# EAGLE schematic dev-board1 (EAGLE 9.0.1)
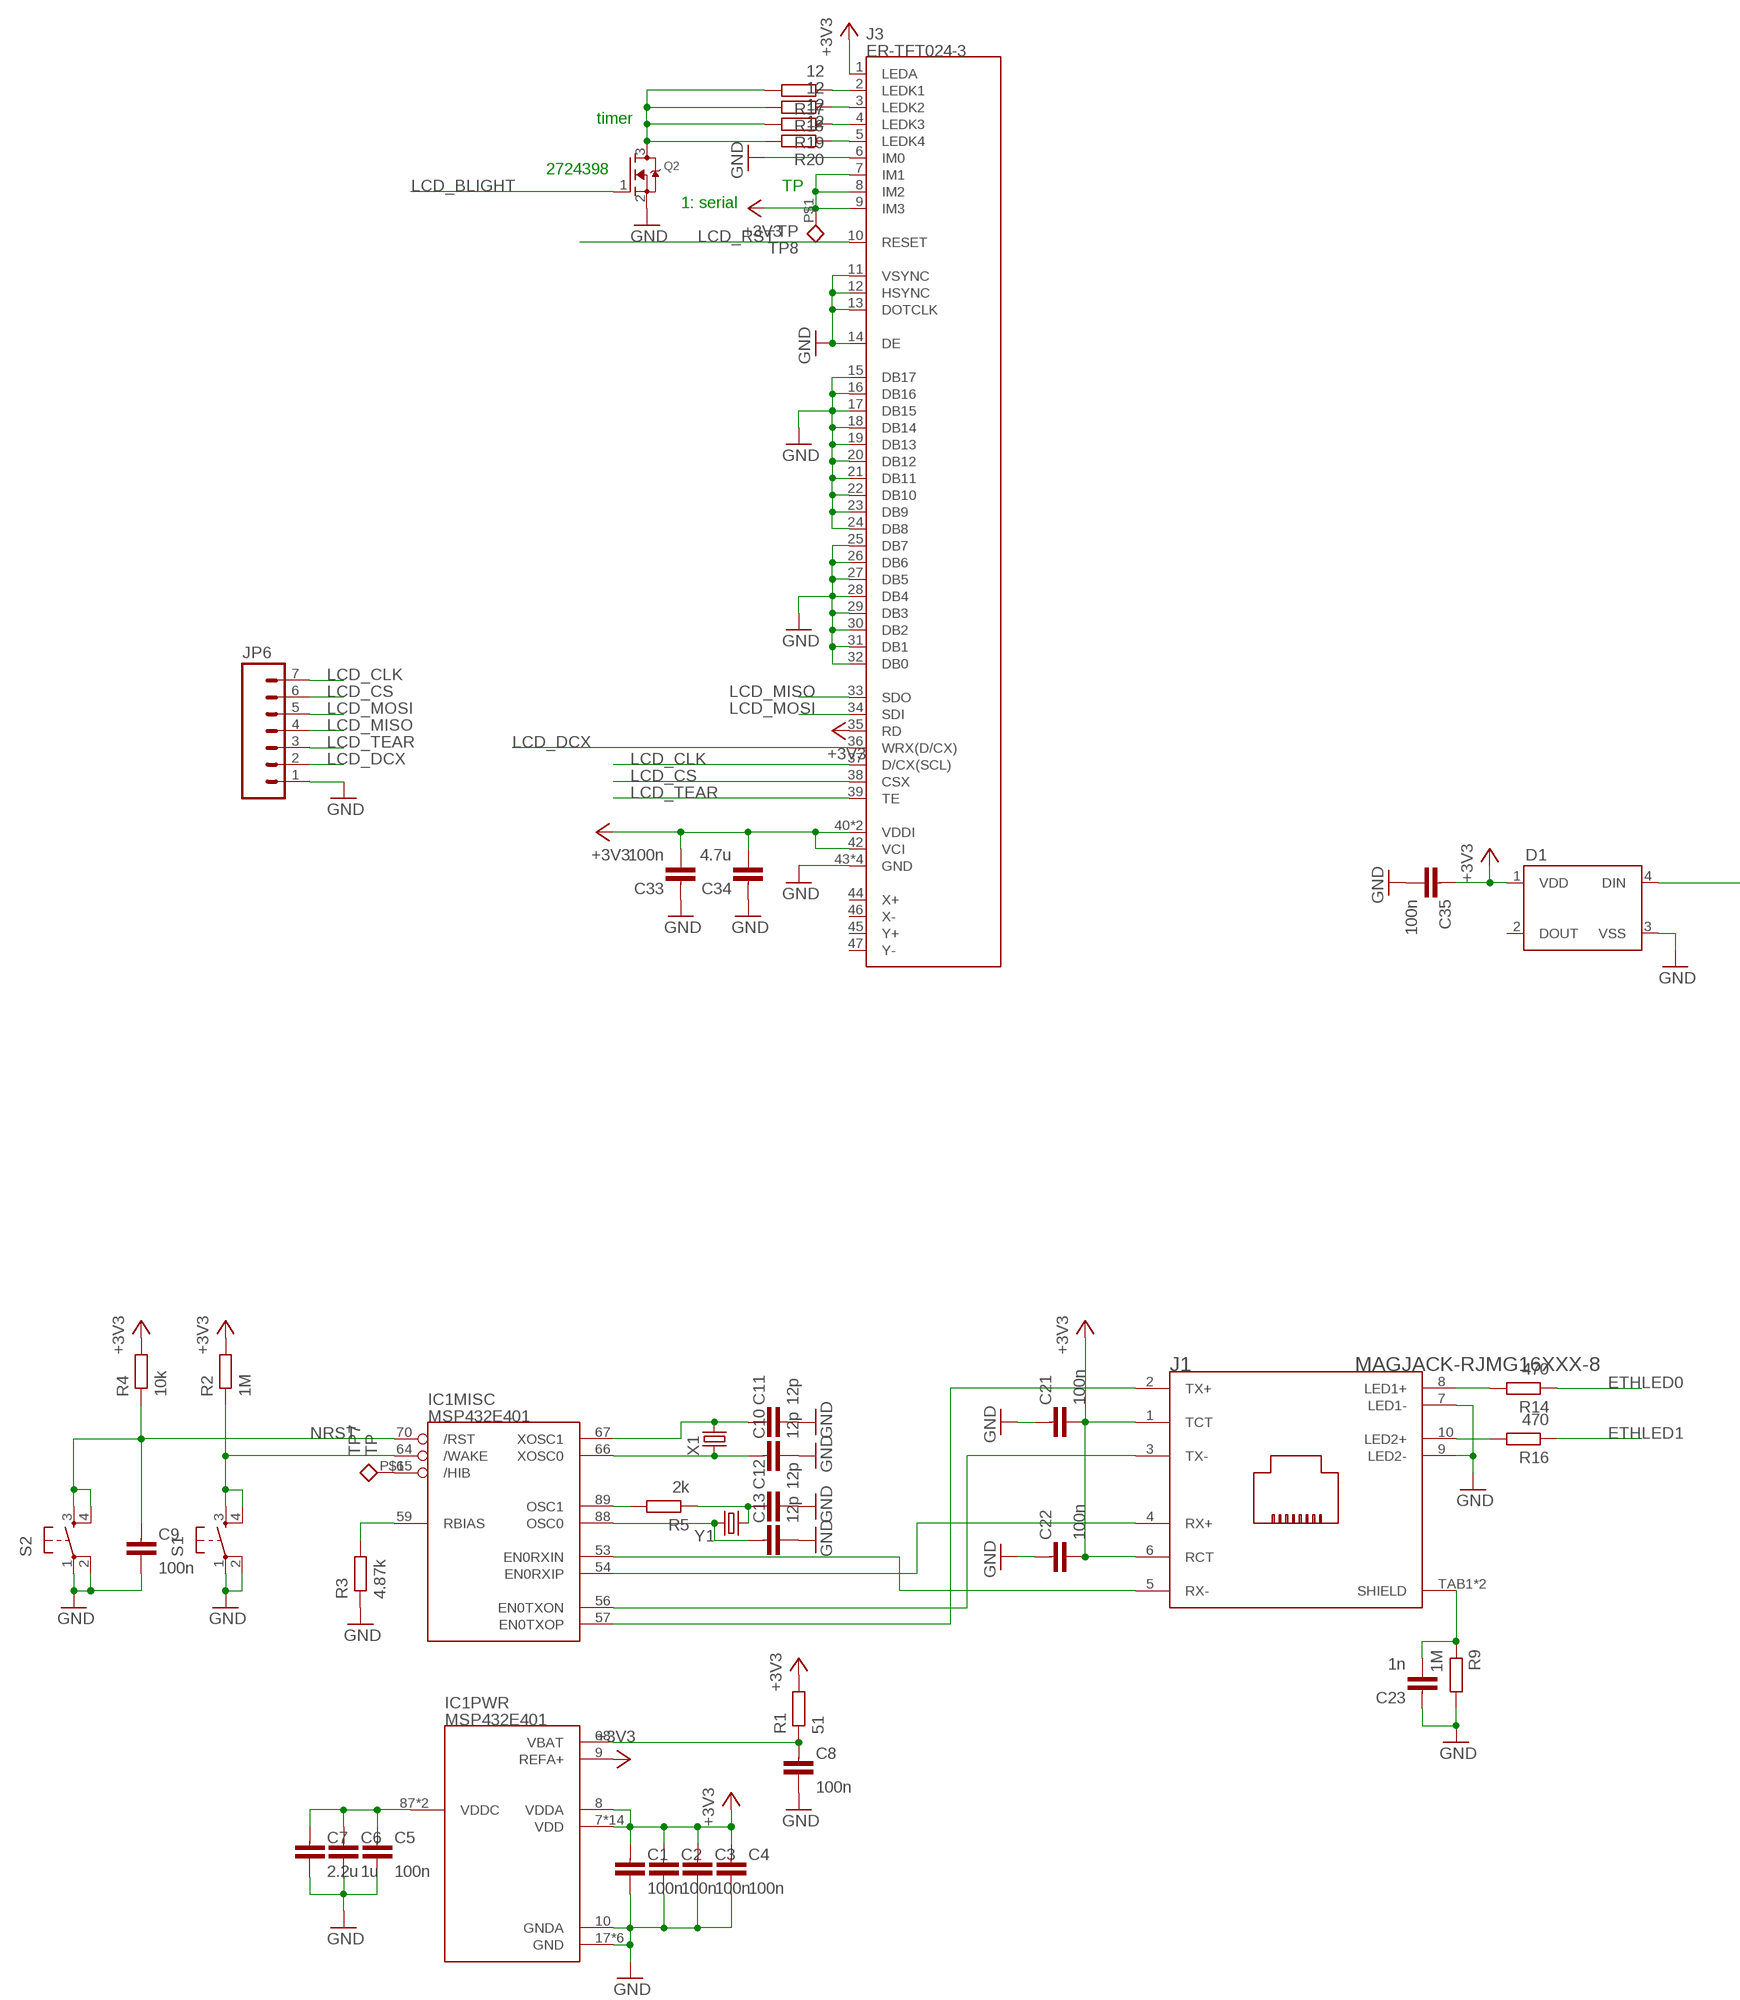
[diagram p0: schematic, sheet 1, part 1 of 3]
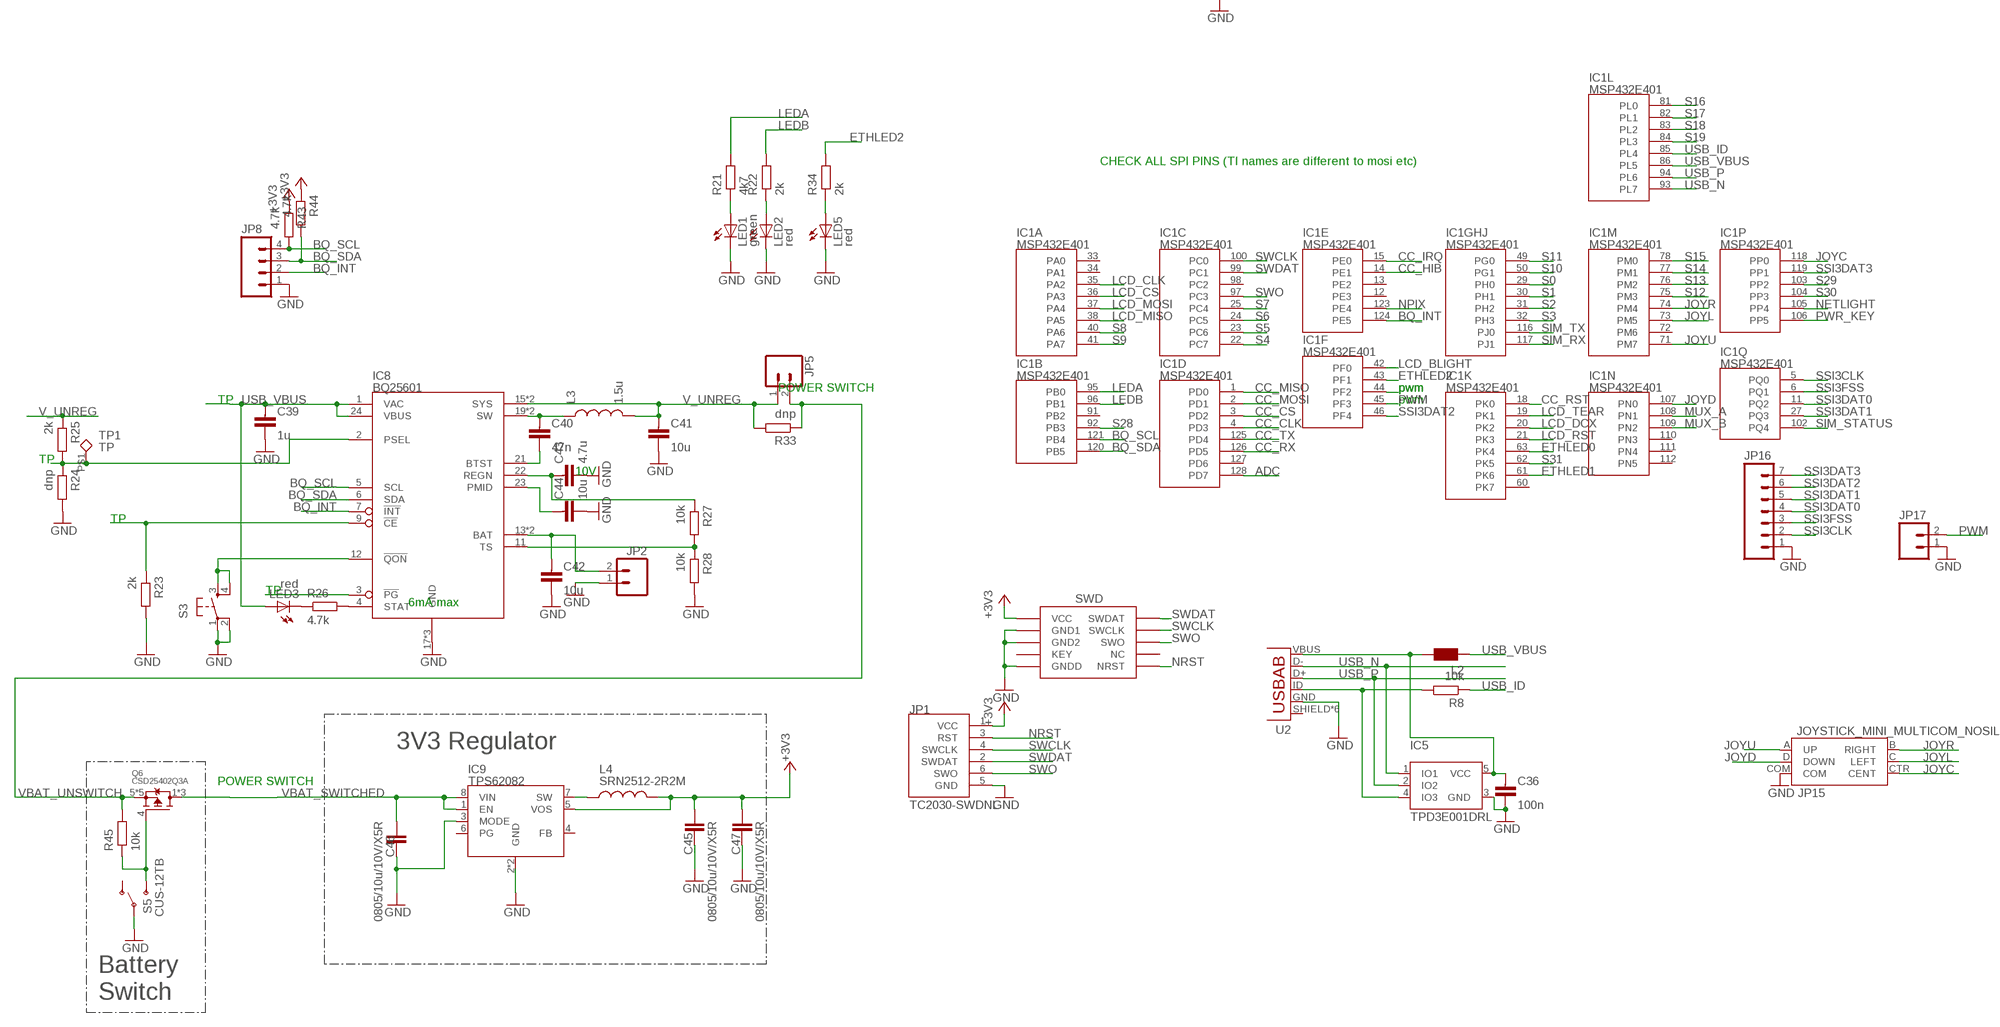
[diagram p1: schematic, sheet 1, part 2 of 3]
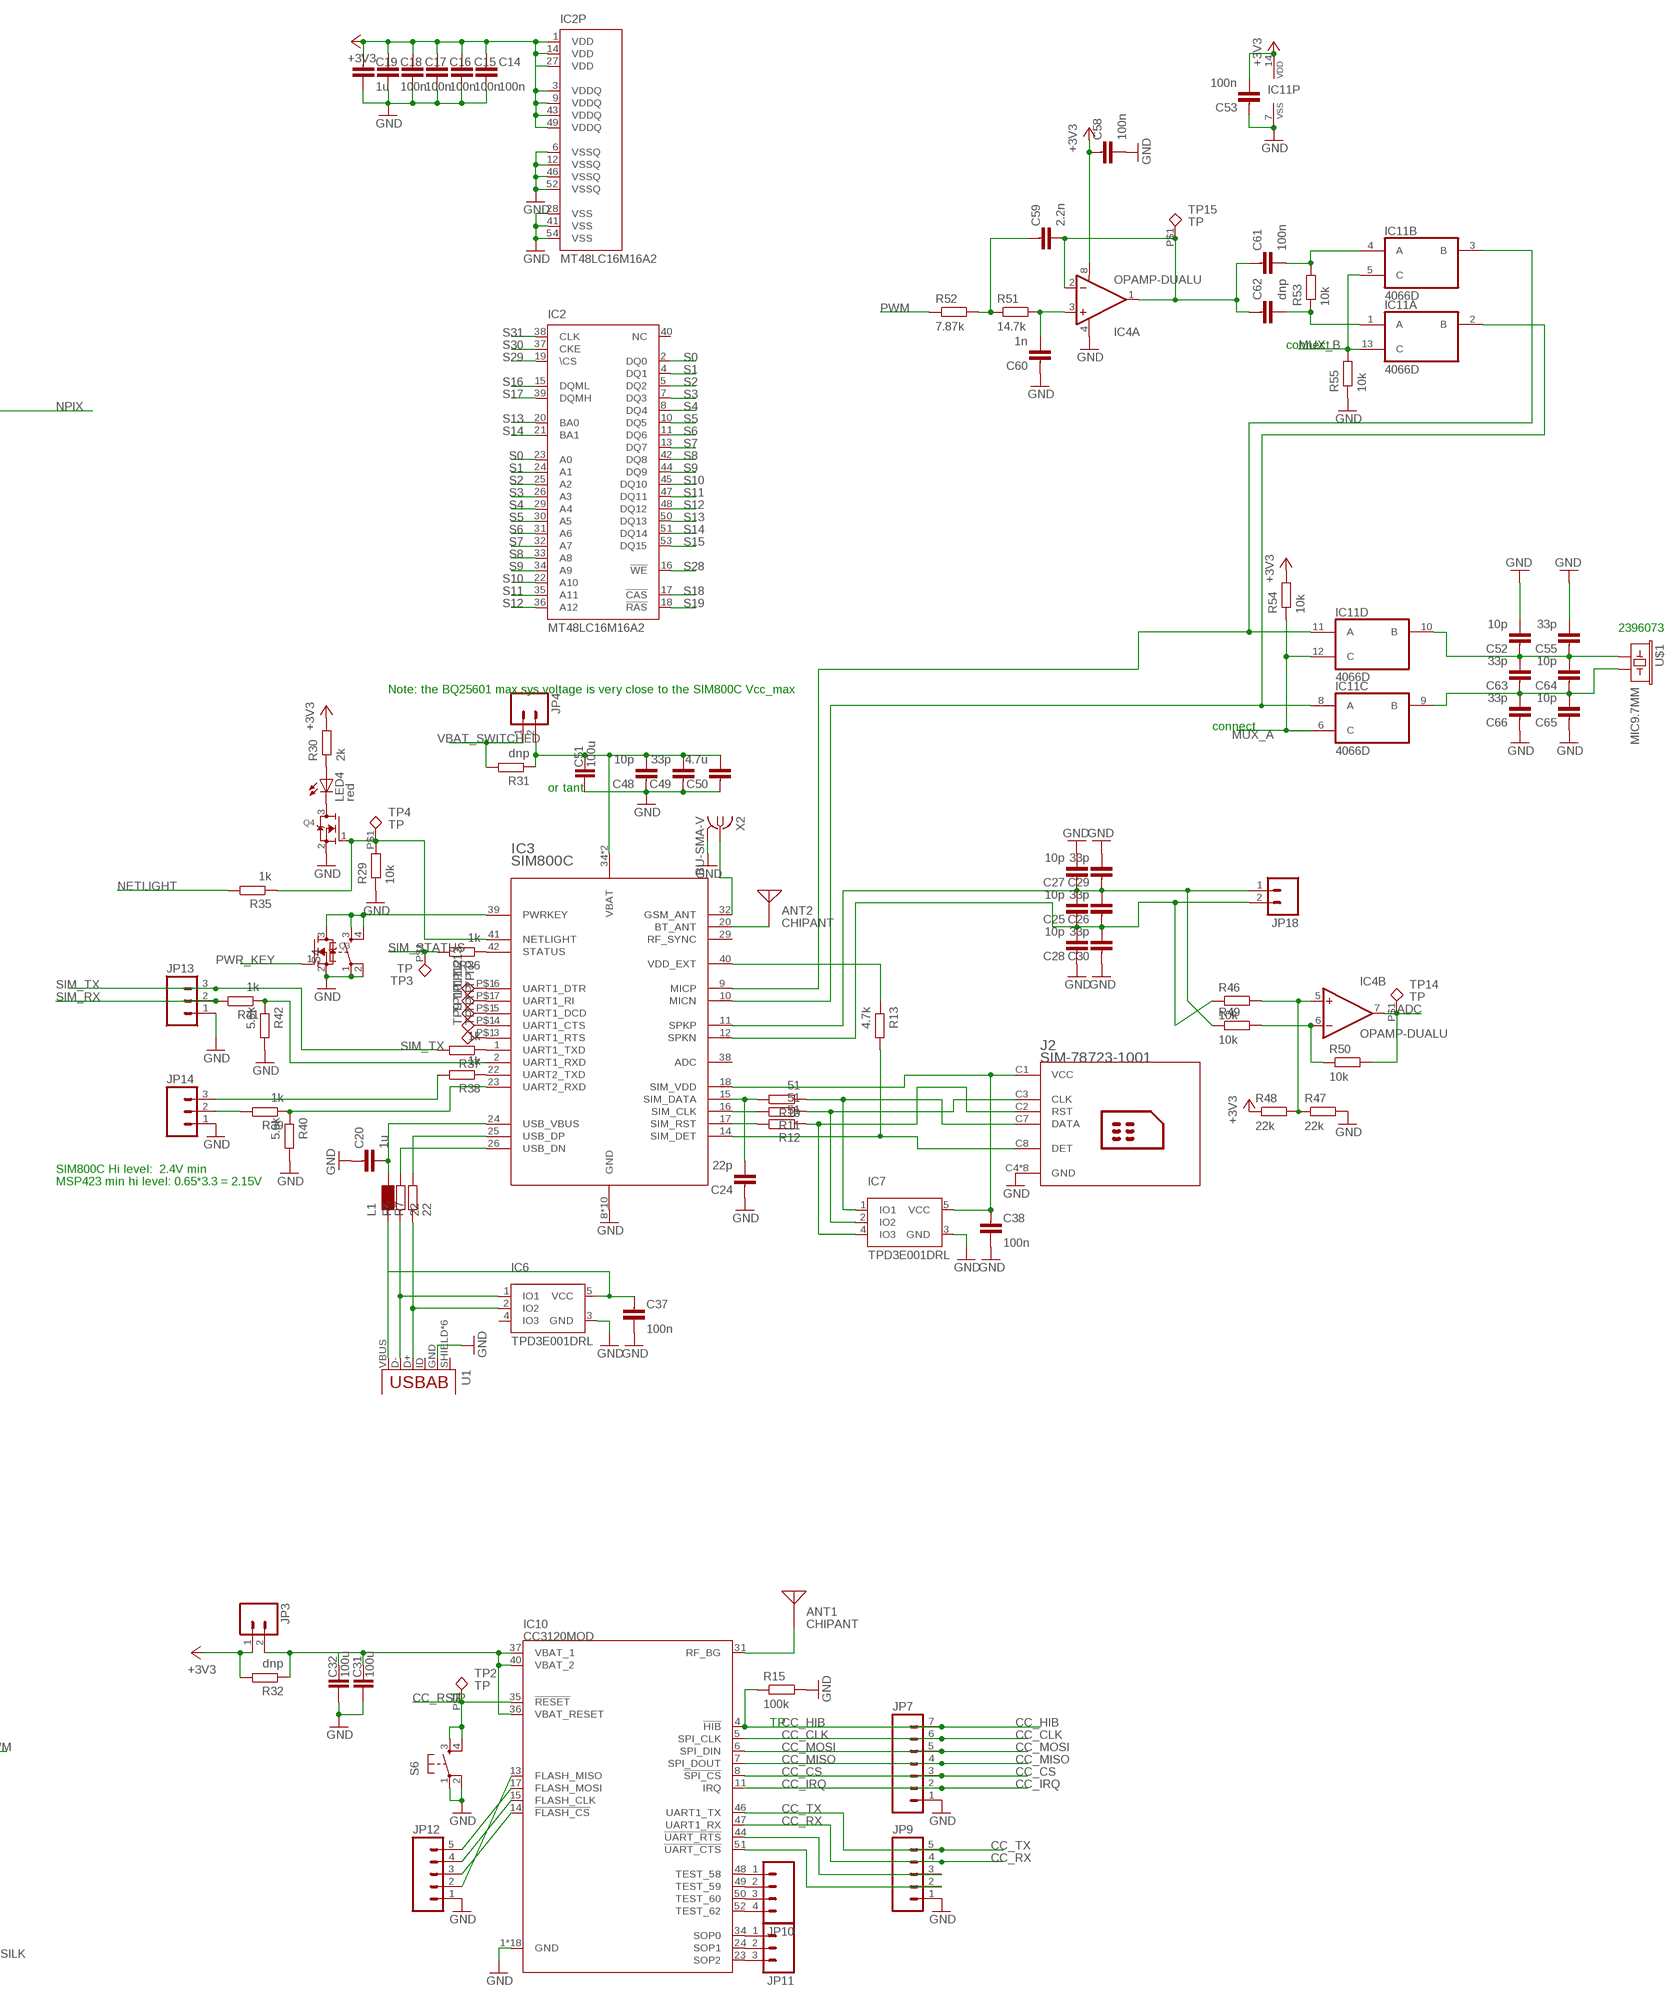
[diagram p2: schematic, sheet 1, part 3 of 3]

## Parts
ANT1  CHIPANT  [2450AT42A100]
ANT2  CHIPANT  [2450AT42A100]
C1  100n  CAPACITOR0603-N  [C0603-N]
C2  100n  CAPACITOR0603-N  [C0603-N]
C3  100n  CAPACITOR0603-N  [C0603-N]
C4  100n  CAPACITOR0603-N  [C0603-N]
C5  100n  CAPACITOR0603-N  [C0603-N]
C6  1u  CAPACITOR0603-N  [C0603-N]
C7  2.2u  CAPACITOR0603-N  [C0603-N]
C8  100n  CAPACITOR0603-N  [C0603-N]
C9  100n  CAPACITOR0603-N  [C0603-N]
C10  12p  CAPACITOR0603-N  [C0603-N]
C11  12p  CAPACITOR0603-N  [C0603-N]
C12  12p  CAPACITOR0603-N  [C0603-N]
C13  12p  CAPACITOR0603-N  [C0603-N]
C14  100n  CAPACITOR0603-N  [C0603-N]
C15  100n  CAPACITOR0603-N  [C0603-N]
C16  100n  CAPACITOR0603-N  [C0603-N]
C17  100n  CAPACITOR0603-N  [C0603-N]
C18  100n  CAPACITOR0603-N  [C0603-N]
C19  1u  CAPACITOR0603-N  [C0603-N]
C20  1u  CAPACITOR0603-N  [C0603-N]
C21  100n  CAPACITOR0603-N  [C0603-N]
C22  100n  CAPACITOR0603-N  [C0603-N]
C23  1n  CAPACITOR0603-N  [C0603-N]
C24  22p  CAPACITOR0603-N  [C0603-N]
C25  10p  CAPACITOR0603-N  [C0603-N]
C26  33p  CAPACITOR0603-N  [C0603-N]
C27  10p  CAPACITOR0603-N  [C0603-N]
C28  10p  CAPACITOR0603-N  [C0603-N]
C29  33p  CAPACITOR0603-N  [C0603-N]
C30  33p  CAPACITOR0603-N  [C0603-N]
C31  100u  C-EUC1210  [C1210]
C32  100u  C-EUC1210  [C1210]
C33  100n  CAPACITOR0603-N  [C0603-N]
C34  4.7u  CAPACITOR0603-N  [C0603-N]
C35  100n  CAPACITOR0603-N  [C0603-N]
C36  100n  CAPACITOR0603-N  [C0603-N]
C37  100n  CAPACITOR0603-N  [C0603-N]
C38  100n  CAPACITOR0603-N  [C0603-N]
C39  1u  CAPACITOR0603-N  [C0603-N]
C40  47n  CAPACITOR0603-N  [C0603-N]
C41  10u  CAPACITOR0805-N  [C0805-N]
C42  10u  CAPACITOR0805-N  [C0805-N]
C43  4.7u  CAPACITOR0603-N  [C0603-N]
C44  10u  CAPACITOR0805-N  [C0805-N]
C45  0805/10u/10V/X5R  C-EUC0805-N  [C0805-N]
C46  0805/10u/10V/X5R  C-EUC0805-N  [C0805-N]
C47  0805/10u/10V/X5R  C-EUC0805-N  [C0805-N]
C48  10p  CAPACITOR0603-N  [C0603-N]
C49  33p  CAPACITOR0603-N  [C0603-N]
C50  4.7u  CAPACITOR0603-N  [C0603-N]
C51  100u  C-EUC1210  [C1210]
C52  10p  CAPACITOR0603-N  [C0603-N]
C53  100n  CAPACITOR0603-N  [C0603-N]
C55  33p  CAPACITOR0603-N  [C0603-N]
C58  100n  CAPACITOR0603-N  [C0603-N]
C59  2.2n  CAPACITOR0603-N  [C0603-N]
C60  1n  CAPACITOR0603-N  [C0603-N]
C61  100n  CAPACITOR0603-N  [C0603-N]
C62  dnp  CAPACITOR0603-N  [C0603-N]
C63  33p  CAPACITOR0603-N  [C0603-N]
C64  10p  CAPACITOR0603-N  [C0603-N]
C65  10p  CAPACITOR0603-N  [C0603-N]
C66  33p  CAPACITOR0603-N  [C0603-N]
D1  WS2812B  [WS2812B]
IC1  MSP432E401  [QFP128-0.4]
IC2  MT48LC16M16A2  [TSOP54-400]
IC3  SIM800C  [SIM800C]
IC4  OPAMP-DUALU  [SO08]
IC5  TPD3E001DRL  [DRL-5]
IC6  TPD3E001DRL  [DRL-5]
IC7  TPD3E001DRL  [DRL-5]
IC8  BQ25601  [QFN-24]
IC9  TPS62082  [WSON8]
IC10  CC3120MOD  [CC3100MOD-LWK]
IC11  4066D  [SO14]
J1  MAGJACK-RJMG16XXX-8  [RJMG163118101NR]
J2  SIM-78723-1001  [MSIM-MOLEX]
J3  ER-TFT024-3  [FH12-50S-0.5SH]
J4  SWD_SHROUD  [SWD_PTH_SHROUD]
JP1  TC2030-SWDNL  [TC2030-MCP-NL]
JP2  M02-JST-2MM-SMT  [JST-2-SMD]
JP3  M02PTH  [1X02]
JP4  M02PTH  [1X02]
JP5  M02PTH  [1X02]
JP6  M07  [1X07]
JP7  M07  [1X07]
JP8  M04PTH  [1X04]
JP9  M05PTH  [1X05]
JP10  M04PTH  [1X04]
JP11  M03PTH  [1X03]
JP12  M05PTH  [1X05]
JP13  M03PTH  [1X03]
JP14  M03PTH  [1X03]
JP15  JOYSTICK_MINI_MULTICOM_NOSILK  [JOYSTICK_MULTICOMP_NOSILK]
JP16  M07  [1X07]
JP17  M02PTH  [1X02]
JP18  M02PTH  [1X02]
L1  WE-CBF_0805  [WUERTH-0805]
L2  WE-CBF_0805  [WUERTH-0805]
L3  1.5u  INDUCTOR1008  [1008]
L4  SRN2512-2R2M  INDUCTOR1008  [1008]
LED1  green  LED0603  [LED-0603]
LED2  red  LED0603  [LED-0603]
LED3  red  LED0603  [LED-0603]
LED4  red  LED0603  [LED-0603]
LED5  red  LED0603  [LED-0603]
Q2  MOSFET-N-SOT23-SPARK  [SOT23-3]
Q3  MOSFET-N-SOT23-SPARK  [SOT23-3]
Q4  MOSFET-N-SOT23-SPARK  [SOT23-3]
Q6  CSD25402Q3A  [Q3A]
R1  51  RESISTOR0603-N  [R0603-N]
R2  1M  RESISTOR0603-N  [R0603-N]
R3  4.87k  RESISTOR0603-N  [R0603-N]
R4  10k  RESISTOR0603-N  [R0603-N]
R5  2k  RESISTOR0603-N  [R0603-N]
R6  22  RESISTOR0603-N  [R0603-N]
R7  22  RESISTOR0603-N  [R0603-N]
R8  10k  RESISTOR0603-N  [R0603-N]
R9  1M  RESISTOR0603-N  [R0603-N]
R10  51  RESISTOR0603-N  [R0603-N]
R11  51  RESISTOR0603-N  [R0603-N]
R12  51  RESISTOR0603-N  [R0603-N]
R13  4.7k  RESISTOR0603-N  [R0603-N]
R14  470  RESISTOR0603-N  [R0603-N]
R15  100k  RESISTOR0603-N  [R0603-N]
R16  470  RESISTOR0603-N  [R0603-N]
R17  12  RESISTOR0603-N  [R0603-N]
R18  12  RESISTOR0603-N  [R0603-N]
R19  12  RESISTOR0603-N  [R0603-N]
R20  12  RESISTOR0603-N  [R0603-N]
R21  4k7  RESISTOR0603-N  [R0603-N]
R22  2k  RESISTOR0603-N  [R0603-N]
R23  2k  RESISTOR0603-N  [R0603-N]
R24  dnp  RESISTOR0603-N  [R0603-N]
R25  2k  RESISTOR0603-N  [R0603-N]
R26  4.7k  RESISTOR0603-N  [R0603-N]
R27  10k  RESISTOR0603-N  [R0603-N]
R28  10k  RESISTOR0603-N  [R0603-N]
R29  10k  RESISTOR0603-N  [R0603-N]
R30  2k  RESISTOR0603-N  [R0603-N]
R31  dnp  RESISTOR0603-N  [R0603-N]
R32  dnp  RESISTOR0603-N  [R0603-N]
R33  dnp  RESISTOR0603-N  [R0603-N]
R34  2k  RESISTOR0603-N  [R0603-N]
R35  1k  RESISTOR0603-N  [R0603-N]
R36  1k  RESISTOR0603-N  [R0603-N]
R37  1k  RESISTOR0603-N  [R0603-N]
R38  1k  RESISTOR0603-N  [R0603-N]
R39  1k  RESISTOR0603-N  [R0603-N]
R40  5.6k  RESISTOR0603-N  [R0603-N]
R41  1k  RESISTOR0603-N  [R0603-N]
R42  5.6k  RESISTOR0603-N  [R0603-N]
R43  4.7k  RESISTOR0603-N  [R0603-N]
R44  4.7k  RESISTOR0603-N  [R0603-N]
R45  10k  RESISTOR0603-N  [R0603-N]
R46  10k  RESISTOR0603-N  [R0603-N]
R47  22k  RESISTOR0603-N  [R0603-N]
R48  22k  RESISTOR0603-N  [R0603-N]
R49  10k  RESISTOR0603-N  [R0603-N]
R50  10k  RESISTOR0603-N  [R0603-N]
R51  14.7k  RESISTOR0603-N  [R0603-N]
R52  7.87k  RESISTOR0603-N  [R0603-N]
R53  10k  RESISTOR0603-N  [R0603-N]
R54  10k  RESISTOR0603-N  [R0603-N]
R55  10k  RESISTOR0603-N  [R0603-N]
S1  6MMTACTSMSM  [6MMTACTSM]
S2  6MMTACTSMSM  [6MMTACTSM]
S3  6MMTACTSMSM  [6MMTACTSM]
S4  6MMTACTSMSM  [6MMTACTSM]
S5  CUS-12TB  SWITCH-SPST-SMD-A  [SWITCH-SPST-SMD-A]
S6  6MMTACTSMSM  [6MMTACTSM]
TP1  TP  [TP]
TP2  TP  [TP]
TP3  TP  [TP]
TP4  TP  [TP]
TP7  TP  [TP]
TP8  TP  [TP]
TP9  TP  [TP]
TP10  TP  [TP]
TP11  TP  [TP]
TP12  TP  [TP]
TP13  TP  [TP]
TP14  TP  [TP]
TP15  TP  [TP]
U1  USB-AB-LWK  [USB-AB-MICRO-SMD_LWK]
U2  USB-AB-LWK  [USB-AB-MICRO-SMD_LWK]
U$1  MIC9.7MM  [MIC-9.7MM]
X1  RESONATOR_EPSON_FC_145  [RESONATOR_EPSON_FC_145]
X2  BU-SMA-V  [BU-SMA-V]
Y1  CRYSTAL5X3  [CRYSTAL-SMD-5X3]

## Nets
+3V3: C1.1 C2.1 C3.1 C4.1 C14.1 C15.1 C16.1 C17.1 C18.1 C19.1 C21.2 C22.2 C33.2 C34.2 C35.1 C45.1 C47.1 C53.2 C58.1 D1.1(VDD) IC1.7(PWR:VDD) IC1.8(PWR:VDDA) IC1.9(PWR:REFA+) IC1.16(PWR:VDD) IC1.26(PWR:VDD) IC1.28(PWR:VDD) IC1.39(PWR:VDD) IC1.47(PWR:VDD) IC1.51(PWR:VDD) IC1.52(PWR:VDD) IC1.69(PWR:VDD) IC1.79(PWR:VDD) IC1.90(PWR:VDD) IC1.101(PWR:VDD) IC1.113(PWR:VDD) IC1.122(PWR:VDD) IC2.1(VDD) IC2.3(VDDQ) IC2.9(VDDQ) IC2.14(VDD) IC2.27(VDD) IC2.43(VDDQ) IC2.49(VDDQ) IC4.8(A:V+) IC9.5(VOS) IC11.14(P:VDD) J1.1(TCT) J1.6(RCT) J3.1(LEDA) J3.7(IM1) J3.8(IM2) J3.9(IM3) J3.35(RD) J3.40(VDDI) J3.41(VDDI) J3.42(VCI) J4.1(VCC) JP1.1(VCC) JP3.1 L4.2 R1.2 R2.2 R4.2 R30.2 R32.2 R43.1 R44.1 R48.1 R54.2 TP8.P$1
ADC: IC1.128(D:PD7) IC4.7(B:OUT) R50.2 TP14.P$1
BQ_INT: IC1.124(E:PE5) IC8.7(!INT) JP8.2
BQ_SCL: IC1.121(B:PB4) IC8.5(SCL) JP8.4 R43.2
BQ_SDA: IC1.120(B:PB5) IC8.6(SDA) JP8.3 R44.2
CC_CLK: IC1.4(D:PD3) IC10.5(SPI_CLK) JP7.6
CC_CS: IC1.3(D:PD2) IC10.8(!SPI_CS) JP7.3
CC_HIB: IC1.14(E:PE1) IC10.4(!HIB) JP7.7 R15.1
CC_IRQ: IC1.15(E:PE0) IC10.11(IRQ) JP7.2
CC_MISO: IC1.1(D:PD0) IC10.7(SPI_DOUT) JP7.4
CC_MOSI: IC1.2(D:PD1) IC10.6(SPI_DIN) JP7.5
CC_RST: IC1.18(K:PK0) IC10.35(!RESET) S6.3 S6.4 TP2.P$1
CC_RX: IC1.126(D:PD5) IC10.47(UART1_RX) JP9.4
CC_TX: IC1.125(D:PD4) IC10.46(UART1_TX) JP9.5
ETHLED0: IC1.63(K:PK4) R14.1
ETHLED1: IC1.61(K:PK6) R16.1
ETHLED2: IC1.43(F:PF1) R34.2
GGGG: IC3.2(UART1_RXD) R41.1 R42.1
GND: C1.2 C2.2 C3.2 C4.2 C5.2 C6.2 C7.2 C8.2 C9.2 C10.2 C11.2 C12.2 C13.2 C14.2 C15.2 C16.2 C17.2 C18.2 C19.2 C20.1 C21.1 C22.1 C23.1 C24.1 C27.2 C28.1 C29.2 C30.1 C31.2 C32.2 C33.1 C34.1 C35.2 C36.2 C37.2 C38.2 C39.2 C41.2 C42.2 C43.2 C44.2 C45.2 C46.2 C47.2 C48.1 C49.1 C50.1 C51.2 C52.2 C53.1 C55.2 C58.2 C60.1 C65.1 C66.1 D1.3(VSS) IC1.10(PWR:GNDA) IC1.17(PWR:GND) IC1.48(PWR:GND) IC1.55(PWR:GND) IC1.58(PWR:GND) IC1.80(PWR:GND) IC1.114(PWR:GND) IC2.6(VSSQ) IC2.12(VSSQ) IC2.28(VSS) IC2.41(VSS) IC2.46(VSSQ) IC2.52(VSSQ) IC2.54(VSS) IC3.8(GND) IC3.13(GND) IC3.19(GND) IC3.21(GND) IC3.27(GND) IC3.30(GND) IC3.31(GND) IC3.33(GND) IC3.36(GND) IC3.37(GND) IC4.4(A:V-) IC5.3(GND) IC6.3(GND) IC7.3(GND) IC8.17(GND) IC8.18(GND) IC8.25(GND) IC9.2(GND) IC9.3(MODE) IC9.EP(GND) IC10.1(GND) IC10.2(GND) IC10.16(GND) IC10.27(GND) IC10.28(GND) IC10.30(GND) IC10.32(GND) IC10.38(GND) IC10.43(GND) IC10.55(GND) IC10.56(GND) IC10.57(GND) IC10.58(GND) IC10.59(GND) IC10.60(GND) IC10.61(GND) IC10.62(GND) IC10.63(GND) IC11.7(P:VSS) J1.7(LED1-) J1.9(LED2-) J2.C4(GND) J2.C5(GND) J2.GND1(GND) J2.GND2(GND) J2.GND3(GND) J2.GND4(GND) J2.GND5(GND) J2.GND6(GND) J3.6(IM0) J3.11(VSYNC) J3.12(HSYNC) J3.13(DOTCLK) J3.14(DE) J3.15(DB17) J3.16(DB16) J3.17(DB15) J3.18(DB14) J3.19(DB13) J3.20(DB12) J3.21(DB11) J3.22(DB10) J3.23(DB9) J3.24(DB8) J3.25(DB7) J3.26(DB6) J3.27(DB5) J3.28(DB4) J3.29(DB3) J3.30(DB2) J3.31(DB1) J3.32(DB0) J3.43(GND) J3.48(GND) J3.49(GND) J3.50(GND) J4.3(GND1) J4.5(GND2) J4.9(GNDD) JP1.5(GND) JP2.1 JP6.1 JP7.1 JP8.1 JP9.1 JP12.1 JP13.1 JP14.1 JP15.COM JP16.1 JP17.1 LED1.C LED2.C LED5.C Q2.2(S) Q3.2(S) Q4.2(S) R3.1 R9.2 R15.2 R23.2 R24.2 R28.2 R29.1 R40.2 R42.2 R47.2 R55.1 S1.1 S1.2 S2.1 S2.2 S3.1 S3.2 S4.1 S4.2 S5.2(P) S6.1 S6.2 U1.GND U2.GND X2.2 X2.3 X2.4 X2.5
JOYC: IC1.118(P:PP0) JP15.CTR(CENT)
JOYD: IC1.107(N:PN0) JP15.D(DOWN)
JOYL: IC1.73(M:PM5) JP15.C(LEFT)
JOYR: IC1.74(M:PM4) JP15.B(RIGHT)
JOYU: IC1.71(M:PM7) JP15.A(UP)
LCD_BLIGHT: IC1.42(F:PF0) Q2.1(G)
LCD_CLK: IC1.35(A:PA2) J3.37(D/CX(SCL)) JP6.7
LCD_CS: IC1.36(A:PA3) J3.38(CSX) JP6.6
LCD_DCX: IC1.20(K:PK2) J3.36(WRX(D/CX)) JP6.2
LCD_MISO: IC1.38(A:PA5) J3.33(SDO) JP6.4
LCD_MOSI: IC1.37(A:PA4) J3.34(SDI) JP6.5
LCD_RST: IC1.21(K:PK3) J3.10(RESET)
LCD_TEAR: IC1.19(K:PK1) J3.39(TE) JP6.3
LEDA: IC1.95(B:PB0) R21.2
LEDB: IC1.96(B:PB1) R22.2
MUX_A: IC1.108(N:PN1) IC11.6(C:C) IC11.12(D:C) R54.1
MUX_B: IC1.109(N:PN2) IC11.5(B:C) IC11.13(A:C) R55.2
N$1: IC1.89(MISC:OSC1) R5.2
N$2: C5.1 C6.1 C7.1 IC1.87(PWR:VDDC) IC1.115(PWR:VDDC)
N$3: C42.1 IC8.13(BAT) IC8.14(BAT) JP2.2
N$4: C12.1 R5.1 Y1.1
N$5: C13.1 IC1.88(MISC:OSC0) Y1.3
N$6: C10.1 IC1.66(MISC:XOSC0) X1.P$1
N$7: C8.1 IC1.68(PWR:VBAT) R1.1
N$8: C11.1 IC1.67(MISC:XOSC1) X1.P$2
N$9: IC1.64(MISC:/WAKE) R2.1 S1.3 S1.4
N$10: IC6.1(IO1) R6.1 U1.D-
N$11: IC1.59(MISC:RBIAS) R3.2
N$12: IC3.32(GSM_ANT) X2.1
N$13: IC6.2(IO2) R7.1 U1.D+
N$14: IC3.25(USB_DP) R7.2
N$15: IC3.26(USB_DN) R6.2
N$16: IC5.4(IO3) R8.2 U2.ID(USBID)
N$17: C36.1 IC5.5(VCC) L2.2 U2.VBUS
N$18: C20.2 IC3.24(USB_VBUS) L1.2
N$19: C37.1 IC6.5(VCC) L1.1 U1.VBUS
N$20: IC1.53(MISC:EN0RXIN) J1.5(RX-)
N$21: IC1.54(MISC:EN0RXIP) J1.4(RX+)
N$22: IC1.56(MISC:EN0TXON) J1.3(TX-)
N$23: IC1.57(MISC:EN0TXOP) J1.2(TX+)
N$24: C23.2 J1.TAB1(SHIELD) J1.TAB2(SHIELD) R9.1
N$25: J1.8(LED1+) R14.2
N$26: J1.10(LED2+) R16.2
N$27: C24.2 IC3.15(SIM_DATA) R10.2
N$28: IC3.16(SIM_CLK) R11.2
N$29: IC3.17(SIM_RST) R12.2
N$30: IC7.1(IO1) J2.C7(DATA) R10.1
N$31: IC7.2(IO2) J2.C3(CLK) R11.1
N$32: IC7.4(IO3) J2.C2(RST) R12.1
N$33: IC3.14(SIM_DET) J2.C8(DET) R13.2
N$34: IC3.40(VDD_EXT) R13.1
N$35: C38.1 IC3.18(SIM_VDD) IC7.5(VCC) J2.C1(VCC)
N$36: IC1.44(F:PF2)
N$37: IC4.5(B:+IN) R46.2 R47.1 R48.2
N$38: IC3.9(MICP) IC11.3(B:B) IC11.11(D:A)
N$39: LED5.A R34.1
N$40: C25.2 C26.2 C27.1 C29.1 IC3.11(SPKP) JP18.1 R49.1
N$41: C25.1 C26.1 C28.2 C30.2 IC3.12(SPKN) JP18.2 R46.1
N$42: IC3.10(MICN) IC11.2(A:B) IC11.8(C:A)
N$43: IC10.48(TEST_58) JP10.1
N$44: IC10.44(!UART_RTS) JP9.3
N$45: C48.2 C49.2 C50.2 C51.1 IC3.34(VBAT) IC3.35(VBAT) JP4.2 R31.1
N$46: LED4.C Q4.3(D)
N$48: ANT1.P$1 IC10.31(RF_BG)
N$49: IC10.51(!UART_CTS) JP9.2
N$50: C31.1 C32.1 IC10.36(VBAT_RESET) IC10.37(VBAT_1) IC10.40(VBAT_2) JP3.2 R32.1
N$51: IC10.49(TEST_59) JP10.2
N$52: IC10.50(TEST_60) JP10.3
N$53: IC3.39(PWRKEY) Q3.3(D) S4.3 S4.4
N$54: IC10.52(TEST_62) JP10.4
N$55: IC10.34(SOP0) JP11.1
N$56: J3.2(LEDK1) R17.1
N$57: J3.3(LEDK2) R18.1
N$58: J3.4(LEDK3) R19.1
N$59: J3.5(LEDK4) R20.1
N$60: Q2.3(D) R17.2 R18.2 R19.2 R20.2
N$61: IC10.24(SOP1) JP11.2
N$62: ANT2.P$1 IC3.20(BT_ANT)
N$63: C40.1 IC8.19(SW) IC8.20(SW) L3.1
N$64: LED4.A R30.1
N$65: IC10.23(SOP2) JP11.3
N$66: IC10.15(FLASH_CLK) JP12.4
N$67: LED1.A R21.1
N$68: LED2.A R22.1
N$69: IC10.14(!FLASH_CS) JP12.3
N$70: IC10.17(FLASH_MOSI) JP12.5
N$71: IC10.13(FLASH_MISO) JP12.2
N$72: IC3.22(UART2_TXD) R38.1
N$73: C40.2 IC8.21(BTST)
N$74: C43.1 IC8.22(REGN) R27.1
N$75: C44.1 IC8.23(PMID)
N$76: IC8.12(!QON) S3.3 S3.4
N$77: JP14.3 R38.2
N$78: IC8.9(!CE) R23.1
N$79: IC8.2(PSEL) R24.1 R25.2 TP1.P$1
N$80: IC1.65(MISC:/HIB) TP7.P$1
N$81: C63.1 C64.1 C65.2 C66.2 IC11.9(C:B) U$1.2
N$82: IC3.42(STATUS) R36.1
N$83: IC8.4(STAT) R26.2
N$84: LED3.C R26.1
N$85: IC8.3(!PG)
N$86: IC8.11(TS) R27.2 R28.1
N$87: IC4.6(B:-IN) R49.2 R50.1
N$90: C59.2 C61.1 C62.1 IC4.1(A:OUT) IC4.2(A:-IN) TP15.P$1
N$91: IC3.1(UART1_TXD) R37.1
N$92: IC3.23(UART2_RXD) R39.1 R40.1
N$93: JP14.2 R39.2
N$94: IC3.3(UART1_RTS) TP9.P$1
N$95: IC3.4(UART1_CTS) TP10.P$1
N$96: IC3.5(UART1_DCD) TP11.P$1
N$97: IC3.7(UART1_RI) TP12.P$1
N$98: IC3.6(UART1_DTR) TP13.P$1
N$99: C60.2 IC4.3(A:+IN) R51.2
N$100: C59.1 R51.1 R52.2
N$101: C61.2 IC11.4(B:A) R53.2
N$102: C62.2 IC11.1(A:A) R53.1
N$108: C52.1 C55.1 C63.2 C64.2 IC11.10(D:B) U$1.1
NETLIGHT: IC1.105(P:PP4) R35.2
NETLIGHT_: IC3.41(NETLIGHT) Q4.1(G) R29.2 R35.1 TP4.P$1
NPIX: D1.4(DIN) IC1.123(E:PE4)
NRST: C9.1 IC1.70(MISC:/RST) J4.10(NRST) JP1.3(RST) R4.1 S2.3 S2.4
PWM: IC1.45(F:PF3) JP17.2 R52.1
PWR_KEY: IC1.106(P:PP5) Q3.1(G)
S0: IC1.29(GHJ:PH0) IC2.2(DQ0) IC2.23(A0)
S1: IC1.30(GHJ:PH1) IC2.4(DQ1) IC2.24(A1)
S2: IC1.31(GHJ:PH2) IC2.5(DQ2) IC2.25(A2)
S3: IC1.32(GHJ:PH3) IC2.7(DQ3) IC2.26(A3)
S4: IC1.22(C:PC7) IC2.8(DQ4) IC2.29(A4)
S5: IC1.23(C:PC6) IC2.10(DQ5) IC2.30(A5)
S6: IC1.24(C:PC5) IC2.11(DQ6) IC2.31(A6)
S7: IC1.25(C:PC4) IC2.13(DQ7) IC2.32(A7)
S8: IC1.40(A:PA6) IC2.33(A8) IC2.42(DQ8)
S9: IC1.41(A:PA7) IC2.34(A9) IC2.44(DQ9)
S10: IC1.50(GHJ:PG1) IC2.22(A10) IC2.45(DQ10)
S11: IC1.49(GHJ:PG0) IC2.35(A11) IC2.47(DQ11)
S12: IC1.75(M:PM3) IC2.36(A12) IC2.48(DQ12)
S13: IC1.76(M:PM2) IC2.20(BA0) IC2.50(DQ13)
S14: IC1.77(M:PM1) IC2.21(BA1) IC2.51(DQ14)
S15: IC1.78(M:PM0) IC2.53(DQ15)
S16: IC1.81(L:PL0) IC2.15(DQML)
S17: IC1.82(L:PL1) IC2.39(DQMH)
S18: IC1.83(L:PL2) IC2.17(!CAS)
S19: IC1.84(L:PL3) IC2.18(!RAS)
S28: IC1.92(B:PB3) IC2.16(!WE)
S29: IC1.103(P:PP2) IC2.19(\CS)
S30: IC1.104(P:PP3) IC2.37(CKE)
S31: IC1.62(K:PK5) IC2.38(CLK)
SIM_RX: IC1.117(GHJ:PJ1) JP13.2 R41.2
SIM_STATUS: IC1.102(Q:PQ4) R36.2 TP3.P$1
SIM_TX: IC1.116(GHJ:PJ0) JP13.3 R37.2
SSI3CLK: IC1.5(Q:PQ0) JP16.2
SSI3DAT0: IC1.11(Q:PQ2) JP16.4
SSI3DAT1: IC1.27(Q:PQ3) JP16.5
SSI3DAT2: IC1.46(F:PF4) JP16.6
SSI3DAT3: IC1.119(P:PP1) JP16.7
SSI3FSS: IC1.6(Q:PQ1) JP16.3
SW: IC9.7(SW) L4.1
SWCLK: IC1.100(C:PC0) J4.4(SWCLK) JP1.4(SWCLK)
SWDAT: IC1.99(C:PC1) J4.2(SWDAT) JP1.2(SWDAT)
SWO: IC1.97(C:PC3) J4.6(SWO) JP1.6(SWO)
USB_ID: IC1.85(L:PL4) R8.1
USB_N: IC1.93(L:PL7) IC5.1(IO1) U2.D-
USB_P: IC1.94(L:PL6) IC5.2(IO2) U2.D+
USB_VBUS: C39.1 IC1.86(L:PL5) IC8.1(VAC) IC8.24(VBUS) L2.1 LED3.A
V_UNREG: C41.1 IC8.15(SYS) IC8.16(SYS) JP5.1 L3.2 R25.1 R33.2
VBAT_SWITCH_CONTROL: Q6.4(G) R45.1 S5.3(S)
VBAT_SWITCHED: C46.1 IC9.1(EN) IC9.8(VIN) JP4.1 Q6.1(D) Q6.2(D) Q6.3(D) R31.2
VBAT_UNSWITCH: JP5.2 Q6.5(S) Q6.6(S) Q6.7(S) Q6.8(S) Q6.EP(S) R33.1 R45.2
Unconnected: D1.2(DOUT) IC1.12(E:PE3) IC1.13(E:PE2) IC1.33(A:PA0) IC1.34(A:PA1) IC1.60(K:PK7) IC1.72(M:PM6) IC1.91(B:PB2) IC1.98(C:PC2) IC1.110(N:PN3) IC1.111(N:PN4) IC1.112(N:PN5) IC1.127(D:PD6) IC2.40(NC) IC3.29(RF_SYNC) IC3.38(ADC) IC6.4(IO3) IC9.4(FB) IC9.6(PG) J3.44(X+) J3.45(Y+) J3.46(X-) J3.47(Y-) J4.7(KEY) J4.8(NC) S5.1(O) U1.ID(USBID) U1.SHIELD U1.SHIELD@0(SHIELD) U1.SHIELD@1(SHIELD) U1.SHIELD@2(SHIELD) U1.SHIELD@3(SHIELD) U1.SHIELD@5(SHIELD) U2.SHIELD U2.SHIELD@0(SHIELD) U2.SHIELD@1(SHIELD) U2.SHIELD@2(SHIELD) U2.SHIELD@3(SHIELD) U2.SHIELD@5(SHIELD)

## Notes on the sheet
- timer
- 2724398
- TP
- 1: serial
- connect
- 2396073
- Note: the BQ25601 max sys voltage is very close to the SIM800C Vcc_max
- connect
- or tant
- SIM800C Hi level:  2.4V min
- MSP423 min hi level: 0.65*3.3 = 2.15V
- CHECK ALL SPI PINS (TI names are different to mosi etc)
- POWER SWITCH | pwm | pwm
- TP | pwm
- TP
- 10V
- TP
- TP
- TP
- TP
- 6mA max
- 3V3 Regulator
- POWER SWITCH
- Battery 
  Switch

## Library data of the parts
ANT1 ANT2 = TiLDA Mk4 Parts:CHIPANT; FARNELL: 2148522
C1-C30 C33 C35-C40 C48 C49 C52 C53 C55 C58-C66 = passives-7351:CAPACITOR
C31 C32 C51 = TiLDA Mk4 Parts:C-EU: CAPACITOR, European symbol; FARNELL: 1889302
C34 C43 C50 = passives-7351:CAPACITOR; FARNELL: 2524873
C41 C42 C44 = passives-7351:CAPACITOR; FARNELL: 2112853/2362101/2576756
C45-C47 = TiLDA Mk3 Parts:C-EU: CAPACITOR, European symbol; FARNELL: 2112853/2362101/2576756
D1 = TiLDA Mk4 Parts:WS2812B: WS2812B - Intelligent control LED integrated light source Technical Specifications: Power Supply Voltage (VDD): 3.5 to 5.3 V Input Voltage (VI): -0.5 to VDD+0.5 V Operating Junction Temperature (Topt): -25°C to +80°C Storage Temperature Range (Tstg): -55°C to +150°C
IC1 = TiLDA Mk4 Parts:MSP432E401
IC2 = memory-micron:MT48LC16M16A2: 256Mb: x16 SDRAM MT48LC16M16A2 - 4 Meg x 16 x 4 banks Source: http://download.micron.com/pdf/datasheets/dram/sdram/256MSDRAM.pdf; FARNELL: 2253738; OC_FARNELL: unknown; OC_NEWARK: unknown
IC3 = TiLDA Mk4 Parts:SIM800C
IC4 = SparkFun-AnalogIC:OPAMP-DUAL: Generic op-amp footprint; FARNELL: 2463666
IC5-IC7 = TiLDA Mk4 Parts:TPD3E001
IC8 = TiLDA Mk4 Parts:BQ25601
IC9 = TiLDA Mk3 Parts:TPS62082; FARNELL: 2064227
IC10 = TiLDA Mk4 Parts:CC3120MOD
IC11 = 40xx:4066: Quad bilateral ANALOG SWITCH; FARNELL: 1201330
J1 = TiLDA Mk4 Parts:MAGJACK-RJMG16XXX; FARNELL: 1357436
J2 = TiLDA Mk4 Parts:SIM-78723-1001; FARNELL: 2213306
J3 = TiLDA Mk4 Parts:ER-TFT024-3
J4 = dtb:SWD_SHROUD; FARNELL: 1865285
JP1 = tag-connect:TC2030-SWD
JP2 = TiLDA Mk4 Parts:M02: Header 2 Standard 2-pin 0.1" header. Use with straight break away headers (SKU : PRT-00116), right angle break away headers (PRT-00553), swiss pins (PRT-00743), machine pins (PRT-00117), and female headers (PRT-00115). Molex polarized connector foot print use with SKU : PRT-08233 with associated crimp pins and housings.; FARNELL: 9492615
JP3-JP5 JP17 JP18 = TiLDA Mk4 Parts:M02: Header 2 Standard 2-pin 0.1" header. Use with straight break away headers (SKU : PRT-00116), right angle break away headers (PRT-00553), swiss pins (PRT-00743), machine pins (PRT-00117), and female headers (PRT-00115). Molex polarized connector foot print use with SKU : PRT-08233 with associated crimp pins and housings.
JP6 JP7 JP16 = TiLDA Mk4 Parts:M07: Header 7 Standard 7-pin 0.1" header. Use with straight break away headers (SKU : PRT-00116), right angle break away headers (PRT-00553), swiss pins (PRT-00743), machine pins (PRT-00117), and female headers (PRT-00115). NOTES ON THE VARIANTS LOCK and LOCK_LONGPADS... This footprint was designed to help hold the alignment of a through-hole component (i.e. 7-pin header) while soldering it into place. You may notice that each hole has been shifted either up or down by 0.005 of an inch from it's more standard position (which is usually a perfectly straight line). This slight alteration caused the pins (the squares in the middle) to touch the edges of the holes. Because they are alternating, it causes a "brace" to hold the header in place. 0.005 has proven to be the perfect amount of "off-center" position when using our standard breakaway headers. Although looks a little odd when you look at the bare footprint, once you have a header in there, the alteration is very hard to notice. Also, if you push a header all the way into place, it is covered up entirely on the bottom side. This idea of altering the position of holes to aid alignment will be further integrated into the Sparkfun Library for other footprints. It can help hold any component with 3 or more connection pins.
JP8 JP10 = TiLDA Mk4 Parts:M04: Header 4 Standard 4-pin 0.1" header. Use with straight break away headers (SKU : PRT-00116), right angle break away headers (PRT-00553), swiss pins (PRT-00743), machine pins (PRT-00117), and female headers (PRT-00115). Molex polarized connector foot print use with SKU : PRT-08231 with associated crimp pins and housings. 1MM SMD Version SKU: PRT-10208
JP9 JP12 = TiLDA Mk4 Parts:M05: Header 5 Standard 5-pin 0.1" header. Use with straight break away headers (SKU : PRT-00116), right angle break away headers (PRT-00553), swiss pins (PRT-00743), machine pins (PRT-00117), and female headers (PRT-00115). Molex polarized connector foot print use with SKU : PRT-08230 with associated crimp pins and housings.
JP11 JP13 JP14 = TiLDA Mk4 Parts:M03: Header 3 Standard 3-pin 0.1" header. Use with straight break away headers (SKU : PRT-00116), right angle break away headers (PRT-00553), swiss pins (PRT-00743), machine pins (PRT-00117), and female headers (PRT-00115). Molex polarized connector foot print use with SKU : PRT-08232 with associated crimp pins and housings.
JP15 = TiLDA Mk4 Parts:JOYSTICK_MINI; FARNELL: 1316987
L1 L2 = TiLDA Mk4 Parts:WE-CBF: SMD EMI Suppression Ferrite Beads - excellent anti-EMI properties - low DCR - impedances till 3000 ohms - rated current up to 6 A; FARNELL: 1781089
L3 = TiLDA Mk4 Parts:INDUCTOR: Inductors Basic Inductor/Choke - 0603 and 1206. Footprints are not proven and vary greatly between part numbers.; FARNELL: 2428202
L4 = TiLDA Mk3 Parts:INDUCTOR: Inductors Basic Inductor/Choke - 0603 and 1206. Footprints are not proven and vary greatly between part numbers.; FARNELL: 2428203
LED1 = TiLDA Mk4 Parts:LED: LEDs Standard schematic elements and footprints for 5mm, 3mm, 1206, and 0603 sized LEDs. 5mm - Spark Fun Electronics SKU : COM-00529 (and others); FARNELL: 2426215
LED2-LED5 = TiLDA Mk4 Parts:LED: LEDs Standard schematic elements and footprints for 5mm, 3mm, 1206, and 0603 sized LEDs. 5mm - Spark Fun Electronics SKU : COM-00529 (and others); FARNELL: 2449874
Q2 = TiLDA Mk4 Parts:MOSFET-N: N-Channel Mosfet 2N7002E - 60V 260mA SOT23 [Digikey: 2N7002ET1GOSTR-ND] - REEL BSH103 - 30V 850mA SOT23 [Digikey: 568-5013-1-ND]; FARNELL: 2724398
Q3 Q4 = TiLDA Mk4 Parts:MOSFET-N: N-Channel Mosfet 2N7002E - 60V 260mA SOT23 [Digikey: 2N7002ET1GOSTR-ND] - REEL BSH103 - 30V 850mA SOT23 [Digikey: 568-5013-1-ND]
Q6 = TiLDA Mk3 Parts:CSD25402Q3A; FARNELL: 2501103
R1 R2 R4-R55 = passives-7351:RESISTOR
R3 = passives-7351:RESISTOR; FARNELL: 2447387
S1-S4 S6 = Switches:6MMTACTSM; FARNELL: 2320087
S5 = TiLDA Mk3 Parts:SWITCH-SPST: SPST Switch Simple slide switch. Spark Fun Electronics SKU : COM-00102; FARNELL: 9575146
TP1-TP4 TP7-TP15 = Testpoint:TP
U1 U2 = TiLDA Mk4 Parts:USB-AB: This is a USB AB connector that is compatible with USB OTG. i.e. this connector can serve as a host or device; FARNELL: 2293755
U$1 = SparkFun-Sensors:MIC: Omni-directional electret microphone. 9.7mm standard diameter.; FARNELL: 2396073; PROD_ID: COMP-08856
X1 = TiLDA Mk4 Parts:RESONATOR_EPSON_FC_145; FARNELL: 2723239
X2 = con-coax:BU-SMA-V: FEMALE SMA CONNECTOR Radiall distributor RS 112-3794; FARNELL: 1248990; OC_FARNELL: unknown; OC_NEWARK: unknown
Y1 = SparkFun-FreqCtrl:CRYSTAL: Various standard crystals. Proven footprints.; FARNELL: 2508925; PROD_ID: XTAL-08218

## Net classes
0 default: width 0.15 mm, drill 0.3 mm